# EAGLE design esp-proto-board (EAGLE 7.7.0)
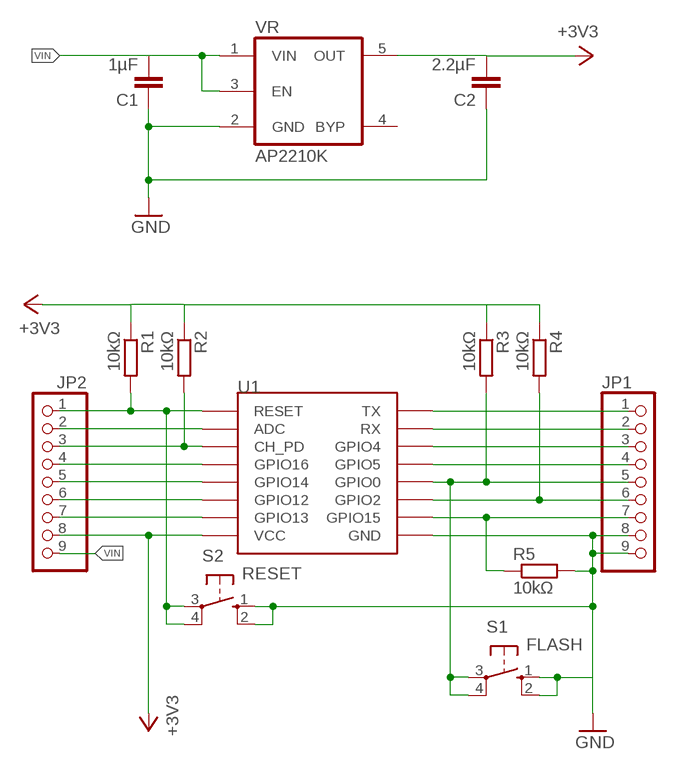
[diagram p0: schematic, sheet 1]

## Parts
C1  1µF  C-EUC0805K  [C0805K]
C2  2.2µF  C-EUC0805K  [C0805K]
JP1  PINHD-1X9  [1X09]
JP2  PINHD-1X9  [1X09]
R1  10kΩ  R-EU_R0805W  [R0805W]
R2  10kΩ  R-EU_R0805W  [R0805W]
R3  10kΩ  R-EU_R0805W  [R0805W]
R4  10kΩ  R-EU_R0805W  [R0805W]
R5  10kΩ  R-EU_R0805W  [R0805W]
S1  FLASH  10-XX  [B3F-10XX]
S2  RESET  10-XX  [B3F-10XX]
U1  ESP12SMD  [ESP12-SMD]
VR  AP2210K  [SOT23-5]

## Nets
+3V3: C2.2 JP2.8 R1.1 R2.1 R3.1 R4.1 U1.VCC VR.5(OUT)
ADC: JP2.2 U1.ADC
CH_PD: JP2.3 R2.2 U1.CH_PD
GND: C1.1 C2.1 JP1.8 JP1.9 R5.2 S1.1(S) S1.2(S1) S2.1(S) S2.2(S1) U1.GND VR.2(GND)
GPIO0: JP1.5 R3.2 S1.3(P) S1.4(P1) U1.GPIO0
GPIO2: JP1.6 R4.2 U1.GPIO2
GPIO4: JP1.3 U1.GPIO4
GPIO5: JP1.4 U1.GPIO5
GPIO12: JP2.6 U1.GPIO12
GPIO13: JP2.7 U1.GPIO13
GPIO14: JP2.5 U1.GPIO14
GPIO15: JP1.7 R5.1 U1.GPIO15
GPIO16: JP2.4 U1.GPIO16
RST: JP2.1 R1.2 S2.3(P) S2.4(P1) U1.RESET
RX: JP1.2 U1.RXD0(RX)
TX: JP1.1 U1.TXD0(TX)
VIN: C1.2 JP2.9 VR.1(VIN) VR.3(EN)
Unconnected: VR.4(BYP)

## Library data of the parts
C1 C2 = rcl:C-EU: CAPACITOR, European symbol
JP1 JP2 = pinhead:PINHD-1X9: PIN HEADER
R1-R5 = rcl:R-EU_: RESISTOR, European symbol
S1 S2 = switch-omron:10-XX: OMRON SWITCH; MPN: B3F-1000; OC_FARNELL: 176432; OC_NEWARK: 36M3542
U1 = esp8266modules:ESP12: ESP8266 Wifi module 12
VR = diodes-inc:AP2210: LDO REGULATOR

## Board
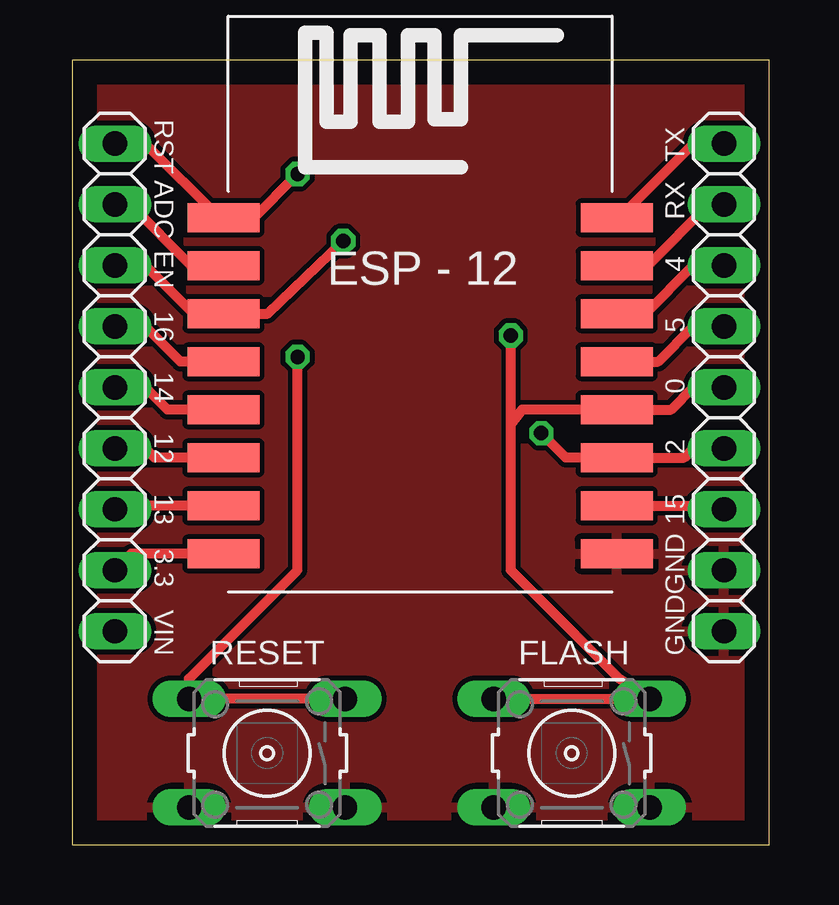
[diagram p1: board, top side]
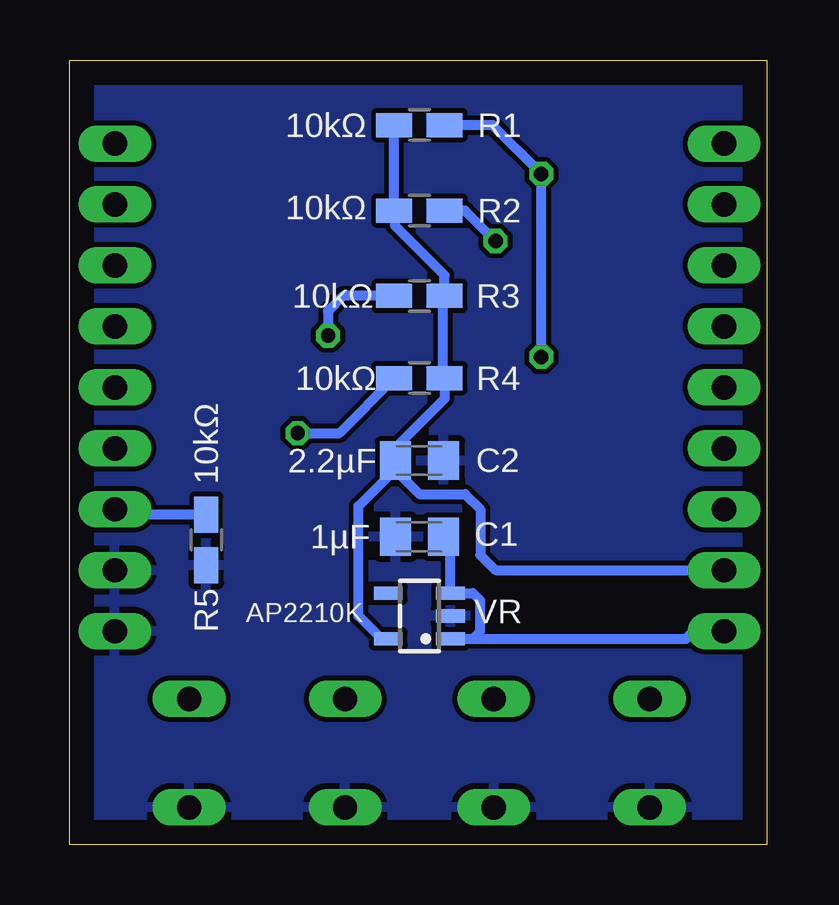
[diagram p2: board, bottom side, seen from below]

Size 29.06 x 32.69 mm. Coordinates in mm from the lower left corner, seen from the top.
Outline: 0,0 29.06,0 29.06,32.69 0,32.69 0,0
Copper layers (1*16): Top 0.035mm / dielectric 1.5mm / Bottom 0.035mm
Design rules "default": minimum track width 10mil, minimum drill 24mil, track to track 8mil, track to pad 8mil, pad to pad 8mil, via to via 8mil, smd to smd 8mil, copper to edge 40mil, drill to drill 8mil, minimum pad ring 10mil, minimum via ring 8mil, stop-mask expansion 4mil, vias tented up to drill 0mil, thermal gap 10mil

### Footprints (pad centres in the part's own frame; a part is rotated, then mirrored left to right if it is on the bottom)
C0805K = smd 1.3 x 1.6: 1 -1,0; 2 1,0
1X09 = drill 1.016 long: 1 -10.16,0; 2 -7.62,0; 3 -5.08,0; 4 -2.54,0; 5 0,0; 6 2.54,0; 7 5.08,0; 8 7.62,0; 9 10.16,0
R0805W = smd 1.5 x 1: 1 -1.052,0; 2 1.052,0
B3F-10XX = drill 1.016 long: 1 -3.251,2.261; 2 3.251,2.261; 3 -3.251,-2.261; 4 3.251,-2.261
ESP12-SMD = smd 3 x 1.2: ADC -8.3,3.8; CH_PD -8.3,1.8; GND 8.1,-8.2; GPIO0 8.1,-2.2; GPIO2 8.1,-4.2; GPIO4 8.1,1.8; GPIO5 8.1,-0.2; GPIO12 -8.3,-4.2; GPIO13 -8.3,-6.2; GPIO14 -8.3,-2.2; GPIO15 8.1,-6.2; GPIO16 -8.3,-0.2; RESET -8.3,5.8; RXD0 8.1,3.8; TXD0 8.1,5.8; VCC -8.3,-8.2
SOT23-5 = smd 0.55 x 1.2: 1 -0.95,-1.3; 2 0,-1.3; 3 0.95,-1.3; 4 0.95,1.3; 5 -0.95,1.3

### Placement (x,y rotation side)
C1  14.48,12.83 0 bottom
C2  14.48,16 180 bottom
JP1  27.18,19.05 270 top
JP2  1.78,19.05 270 top
R1  14.48,29.97 0 bottom
R2  14.48,26.42 0 bottom
R3  14.48,22.86 180 bottom
R4  14.48,19.43 180 bottom
R5  23.37,12.7 270 bottom
S1  20.83,3.81 180 top
S2  8.13,3.81 180 top
U1  14.61,20.32 0 top
VR  14.48,9.53 90 bottom

### Tracks (layer width: path | path; a pad name or v marks a point on that pad's centre or on a via)
+3V3
  Top 0.406: U1.VCC 2.47,12.12 JP2.8
  Bottom 0.406: VR.5 16.07,8.57 17.02,9.53 17.02,14.1 15.62,15.49 C2.2 | C2.2 15.35,15.48 14.48,14.61 12.57,14.61 11.94,13.97 11.94,12.06 11.3,11.43 JP2.8 | R1.1 R2.1 15.49,26.63 15.49,25.78 13.43,23.71 R3.1 | 13.46,22.82 R3.1 | R3.1 13.5,22.79 13.5,19.14 R4.1 13.43,18.58 15.62,16.38 15.62,16.02 C2.2
ADC
  Top 0.406: U1.ADC 4.96,24.12 2.41,26.67 JP2.2
CH_PD  (via drill 0.6)
  Top 0.406: JP2.3 3.05,24.13 5.06,22.12 U1.CH_PD 8.15,22.12 v11.3,25.15
  Bottom 0.406: 13.34,26.16 13.34,26.58 R2.2 12.57,26.42 v11.3,25.15
GND
  pour Bottom: -0.25,33.02 -0.25,0 29.08,0 29.08,33.02
  pour Top: -0.25,33.02 -0.25,0 29.08,-0.13 29.08,32.89
GPIO0  (via drill 0.6)
  Top 0.406: JP1.5 25.91,19.05 24.98,18.12 U1.GPIO0 18.75,18.12 18.29,17.53 | S1.4 S1.3 22.81,6.91 18.29,11.43 18.29,17.53 | 18.29,17.53 v18.29,21.21
  Bottom 0.406: R3.2 17.65,22.86 18.29,22.23 v18.29,21.21
GPIO2  (via drill 0.6)
  Top 0.406: JP1.6 25.91,16.51 25.52,16.12 U1.GPIO2 20.58,16.12 v19.56,17.14
  Bottom 0.406: v19.56,17.14 17.82,17.14 R4.2
GPIO4
  Top 0.406: U1.GPIO4 23.9,22.12 25.91,24.13 JP1.3
GPIO5
  Top 0.406: U1.GPIO5 24.44,20.12 25.91,21.59 JP1.4
GPIO12
  Top 0.406: U1.GPIO12 3.44,16.12 3.05,16.51 JP2.6
GPIO13
  Top 0.406: U1.GPIO13 1.93,14.12 JP2.7
GPIO14
  Top 0.406: U1.GPIO14 3.98,18.12 3.05,19.05 JP2.5
GPIO15
  Top 0.406: U1.GPIO15 27.03,14.12 JP1.7
  Bottom 0.406: R5.1 26.96,13.75 JP1.7
GPIO16
  Top 0.406: U1.GPIO16 4.52,20.12 3.05,21.59 JP2.4
RST  (via drill 0.6)
  Top 0.406: JP2.1 3.05,29.21 6.14,26.12 U1.RESET 6.26,26.04 7.49,26.04 v9.4,27.94 | S2.3 S2.4 4.88,6.91 9.4,11.43 v9.4,20.32
  Bottom 0.406: v9.4,20.32 v9.4,27.94 11.43,29.97 R1.2
RX
  Top 0.406: U1.RXD0 23.99,24.12 26.54,26.67 JP1.2
TX
  Top 0.406: U1.TXD0 22.82,26.12 25.91,29.21 JP1.1
VIN
  Bottom 0.406: JP2.9 3.05,8.89 3.36,8.57 VR.1 12.25,8.57 11.94,8.89 11.94,10.16 12.25,10.47 VR.3 13.18,13.04 C1.2

### Text on the board
tNames: RST | ADC | TX | RX | EN | 4 | 16 | 5 | 14 | 0 | 12 | 2 | 13 | 15 | 3.3 | VIN | GND | GND